# EAGLE design Yun_Shield.v1.1 (EAGLE 6.6.0)

## Sheet 1 of 4
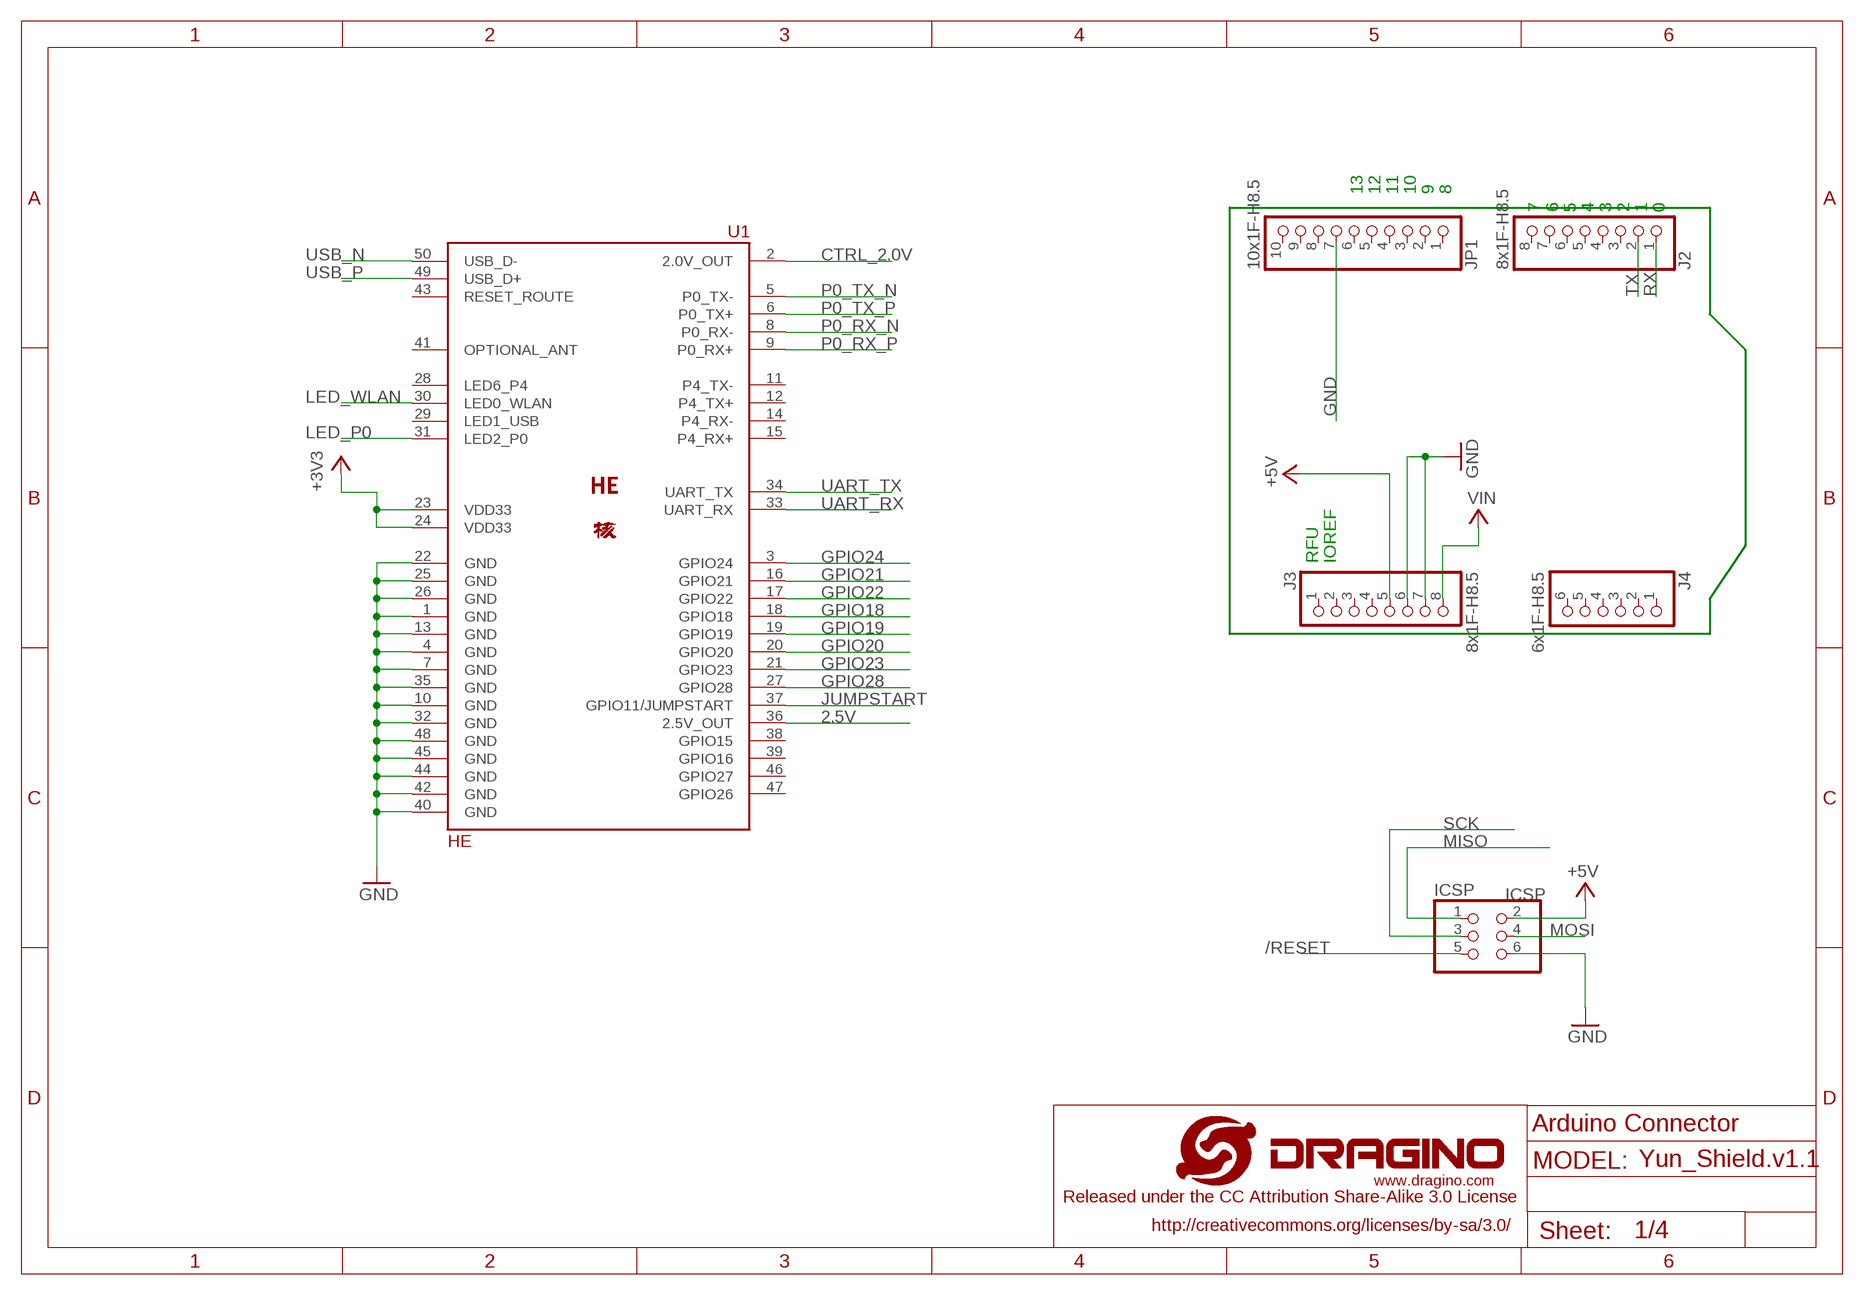
[diagram p0: schematic, sheet 1]

### Parts
ICSP  ICSP  PINHD-2X3  [2X03]
J2  8x1F-H8.5  PINHD-1X8  [1X08]
J3  8x1F-H8.5  PINHD-1X8  [1X08]
J4  6x1F-H8.5  PINHD-1X6  [1X06]
JP1  10x1F-H8.5  PINHD-1X10  [1X10]
U1  HE  [HE50]
U$1  LOGO-NEW  [LOGO-SILK-NEW]

### Nets
2.5V: U1.36(2.5V_OUT) ; also sheet 3
+3V3: U1.23(VDD33) U1.24(VDD33) ; also sheet 2,3,4
+5V [usbvcc]: ICSP.2 J3.5 ; also sheet 2,3,4
/RESET: ICSP.5 ; also sheet 3
CTRL_2.0V: U1.2(2.0V_OUT) ; also sheet 4
GND [gnd]: ICSP.6 J3.6 J3.7 JP1.7 U1.1(GND) U1.4(GND) U1.7(GND) U1.10(GND) U1.13(GND) U1.22(GND) U1.25(GND) U1.26(GND) U1.32(GND) U1.35(GND) U1.40(GND) U1.42(GND) U1.44(GND) U1.45(GND) U1.48(GND) ; also sheet 2,3,4
GPIO18: U1.18(GPIO18) ; also sheet 3
GPIO19: U1.19(GPIO19) ; also sheet 3
GPIO20: U1.20(GPIO20) ; also sheet 3
GPIO21: U1.16(GPIO21) ; also sheet 3
GPIO22: U1.17(GPIO22) ; also sheet 3
GPIO23: U1.21(GPIO23) ; also sheet 3
GPIO24: U1.3(GPIO24) ; also sheet 3
GPIO28: U1.27(GPIO28) ; also sheet 4
JUMPSTART: U1.37(GPIO11/JUMPSTART) ; also sheet 4
LED_P0: U1.31(LED2_P0) ; also sheet 4
LED_WLAN: U1.30(LED0_WLAN) ; also sheet 4
MISO: ICSP.1 ; also sheet 3
MOSI: ICSP.4 ; also sheet 3
P0_RX_N: U1.8(P0_RX-) ; also sheet 4
P0_RX_P: U1.9(P0_RX+) ; also sheet 4
P0_TX_N: U1.5(P0_TX-) ; also sheet 4
P0_TX_P: U1.6(P0_TX+) ; also sheet 4
RX: J2.1 ; also sheet 3
SCK: ICSP.3 ; also sheet 3
TX: J2.2 ; also sheet 3
UART_RX: U1.33(UART_RX) ; also sheet 3
UART_TX: U1.34(UART_TX) ; also sheet 3
USB_N [usbtrace]: U1.50(USB_D-) ; also sheet 4
USB_P [usbtrace]: U1.49(USB_D+) ; also sheet 4
VIN: J3.8 ; also sheet 2
Unconnected: J2.3 J2.4 J2.5 J2.6 J2.7 J2.8 J3.1 J3.2 J3.3 J3.4 J4.1 J4.2 J4.3 J4.4 J4.5 J4.6 JP1.1 JP1.2 JP1.3 JP1.4 JP1.5 JP1.6 JP1.8 JP1.9 JP1.10 U1.11(P4_TX-) U1.12(P4_TX+) U1.14(P4_RX-) U1.15(P4_RX+) U1.28(LED6_P4) U1.29(LED1_USB) U1.38(GPIO15) U1.39(GPIO16) U1.43(RESET_ROUTE) U1.46(GPIO27) U1.47(GPIO26)

### Notes on the sheet
- 13 | 12 | 11 | 10 | 9 | 8
- 7 | 6 | 5 | 4 | 3 | 2 | 1 | 0
- RFU | IOREF
- Arduino Connector

## Sheet 2 of 4
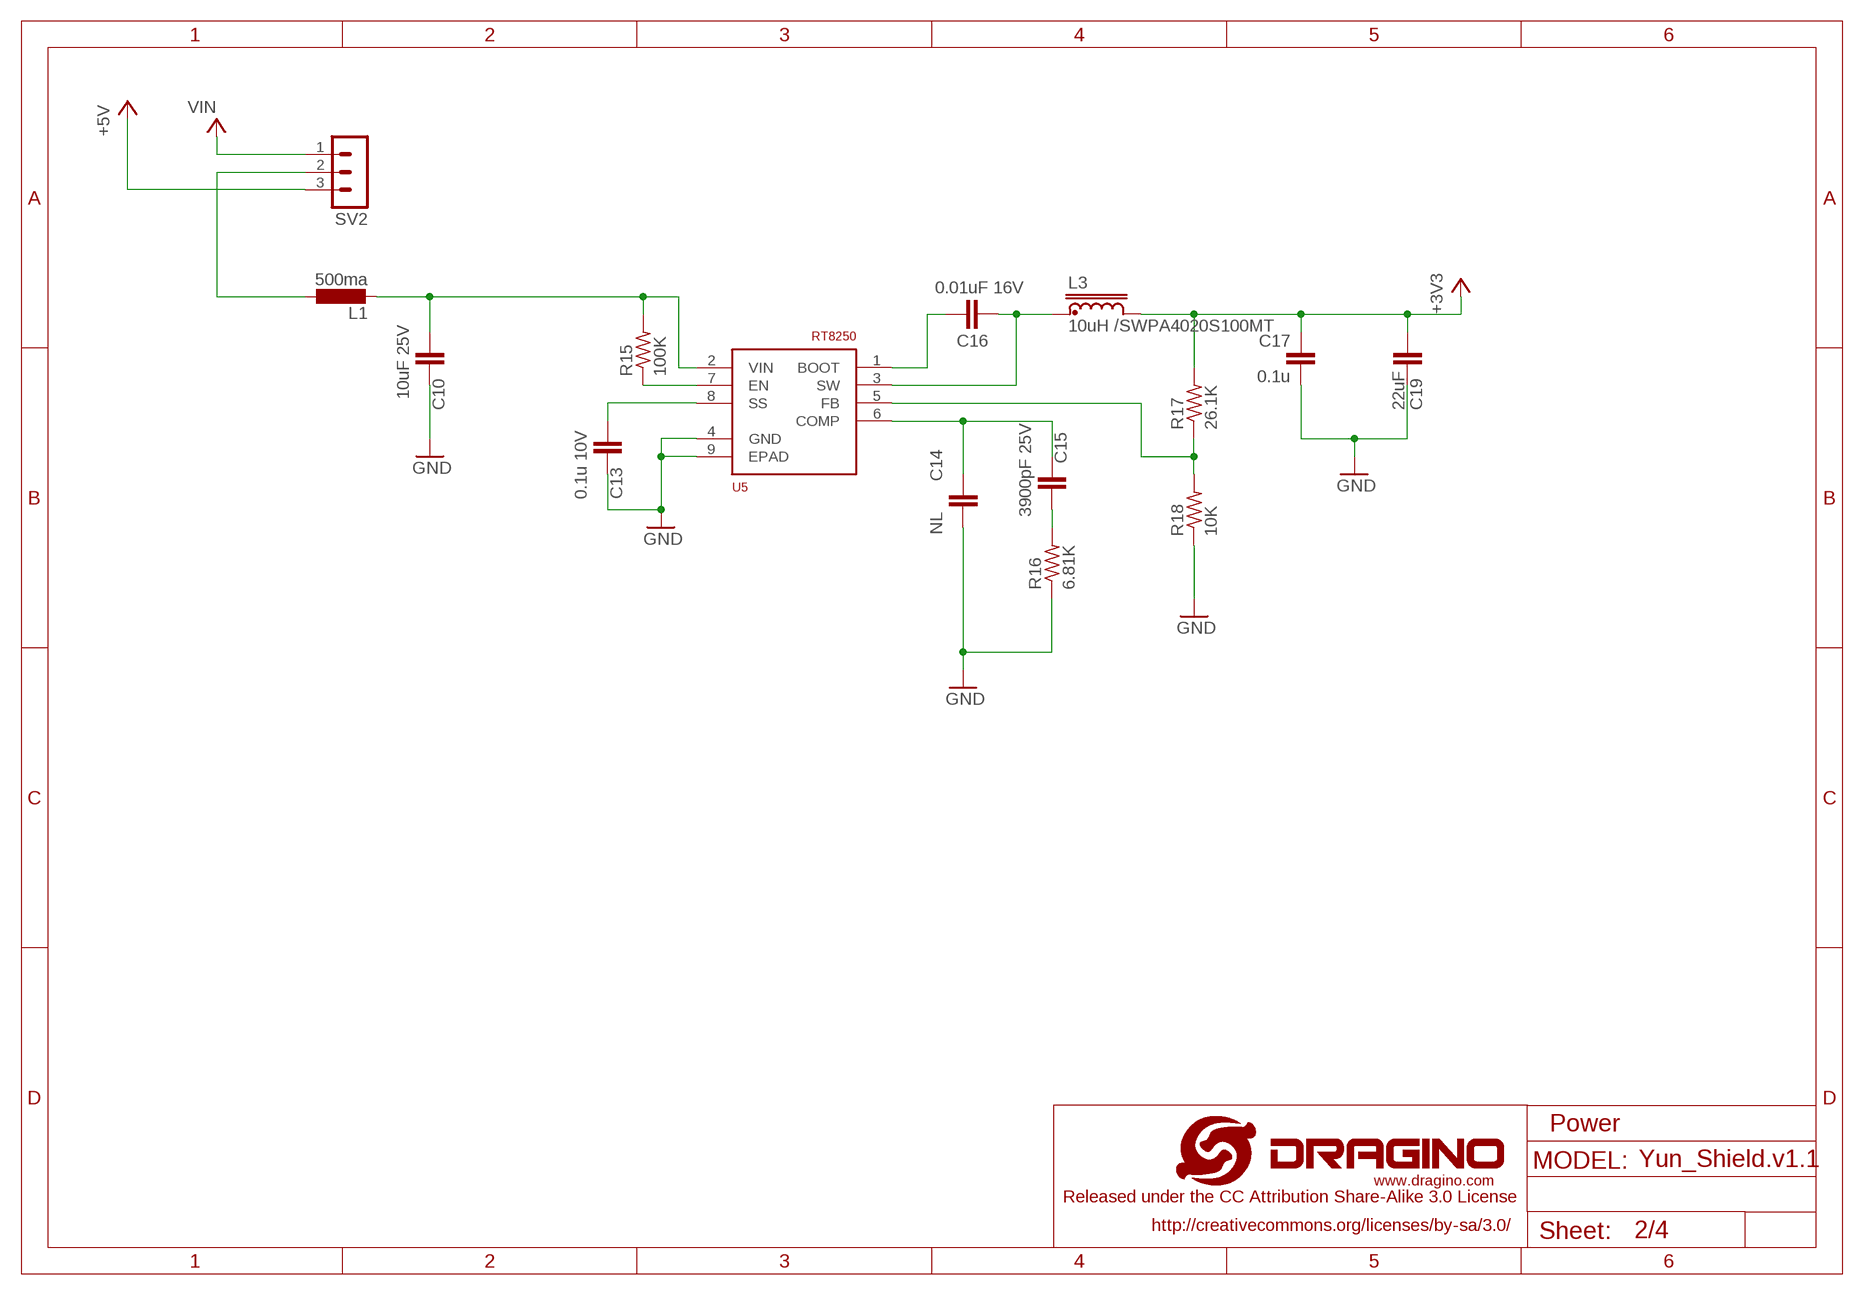
[diagram p1: schematic, sheet 2]

### Parts
C10  10uF 25V  C-EUC1206  [C1206]
C13  0.1u 10V  C-EUC0402  [C0402]
C14  NL  C-EUC0402  [C0402]
C15  3900pF 25V  C-EUC0402  [C0402]
C16  0.01uF 16V  C-EUC0402  [C0402]
C17  0.1u  C-EUC0402  [C0402]
C19  22uF  C-EUC1210  [C1210]
L1  500ma  L-EUL1812  [L1812]
L3  10uH /SWPA4020S100MT  INDUCTORSWPA4020S  [SWPA4020S]
R15  100K  R-US_R0402  [R0402]
R16  6.81K  R-US_R0402  [R0402]
R17  26.1K  R-US_R0402  [R0402]
R18  10K  R-US_R0402  [R0402]
SV2  MA03-1  [MA03-1]
U5  RT8250  [RT8250-SOP8]

### Nets
+3V3: C17.1 C19.1 L3.P$2 R17.2 ; also sheet 1,3,4
+5V [usbvcc]: SV2.3 ; also sheet 1,3,4
GND [gnd]: C10.1 C13.2 C14.2 C17.2 C19.2 R16.1 R18.1 U5.4(GND) U5.9(EPAD) ; also sheet 1,3,4
N$10: C10.2 L1.2 R15.2 U5.2(VIN)
N$13: R15.1 U5.7(EN)
N$14: R17.1 R18.2 U5.5(FB)
N$15: C13.1 U5.8(SS)
N$17: C14.1 C15.1 U5.6(COMP)
N$18: C15.2 R16.2
N$20: C16.1 U5.1(BOOT)
N$21: C16.2 L3.P$1 U5.3(SW)
VCC: L1.1 SV2.2
VIN: SV2.1 ; also sheet 1

### Notes on the sheet
- Power

## Sheet 3 of 4
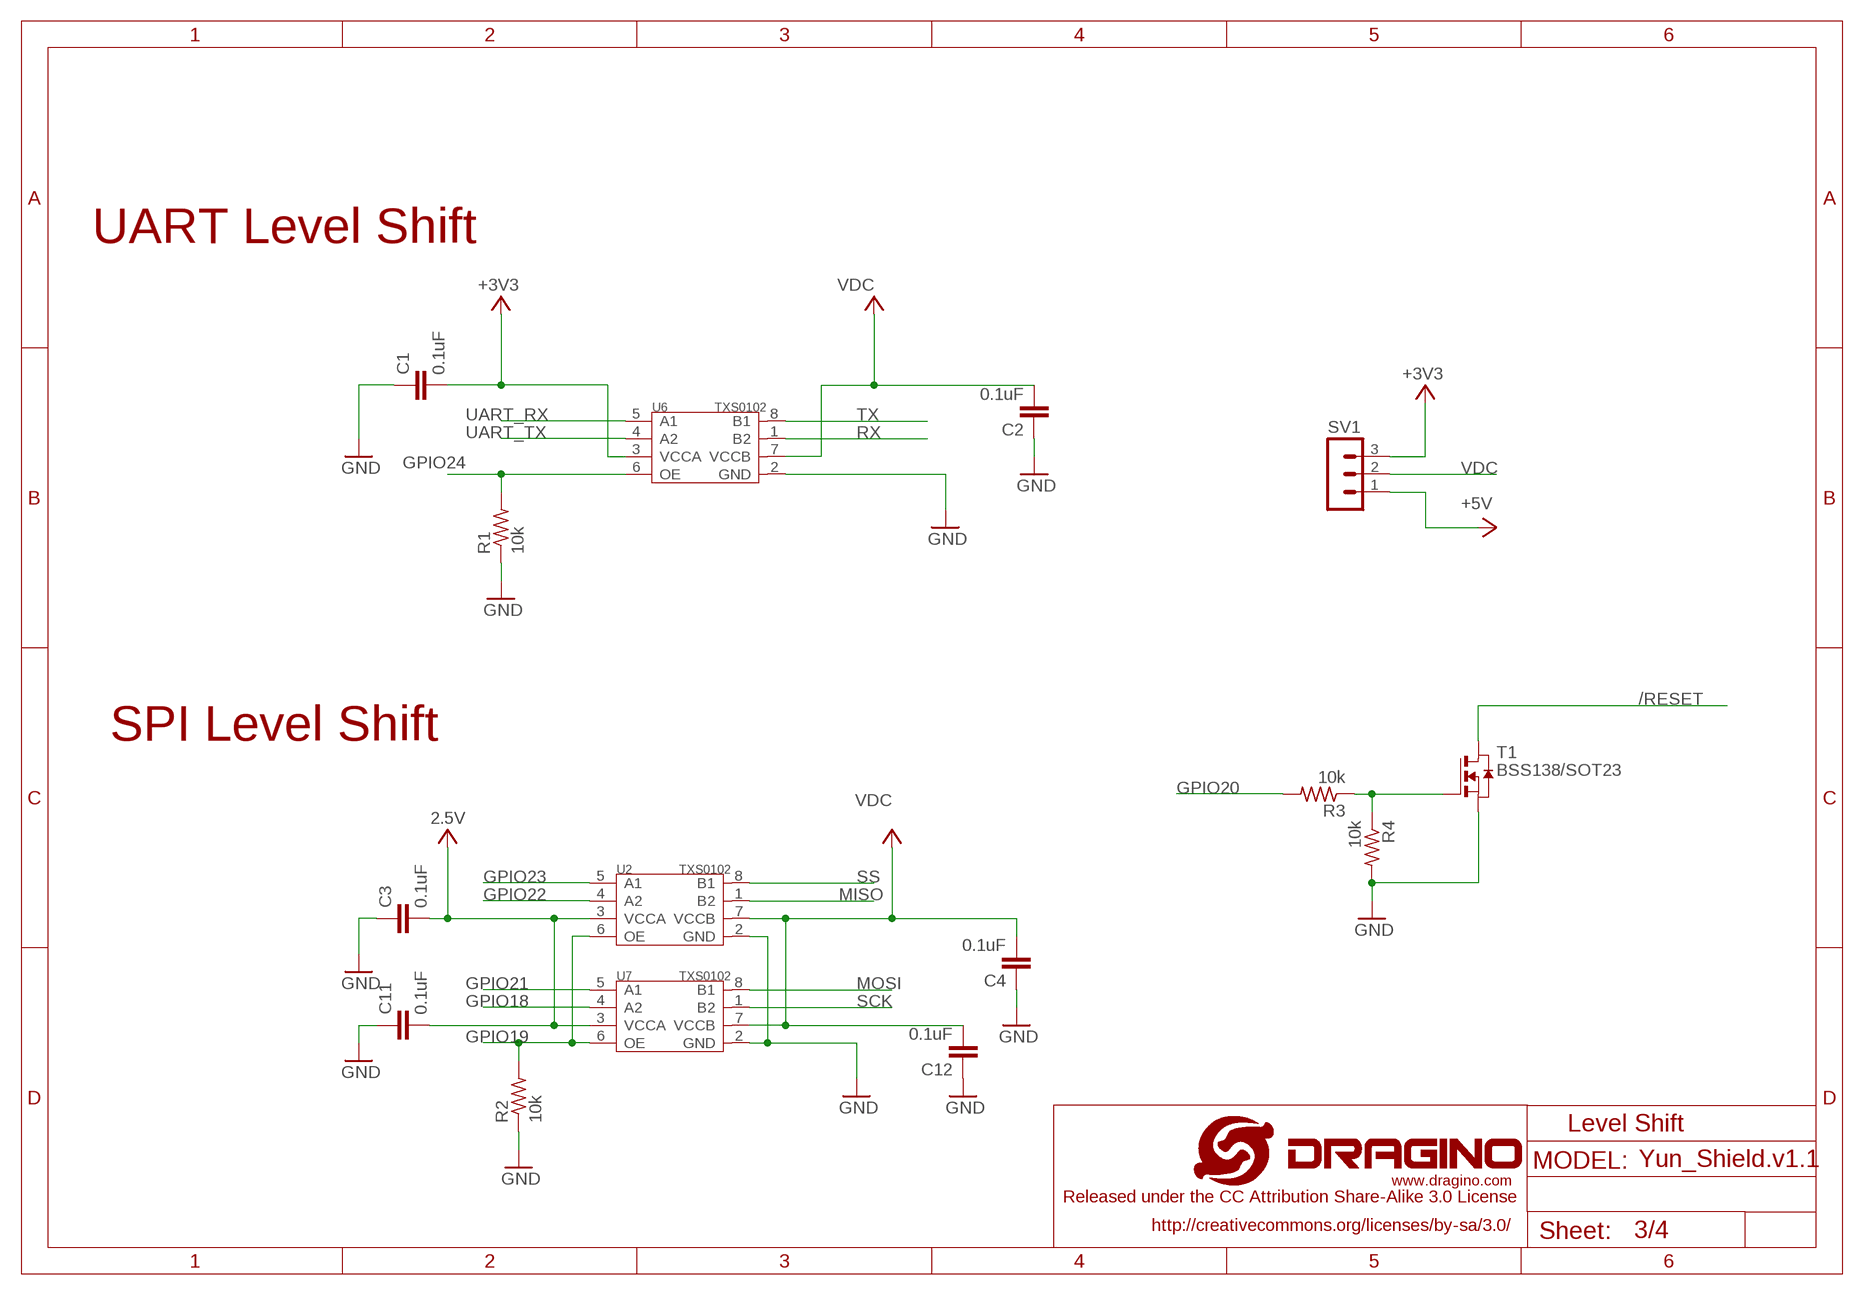
[diagram p2: schematic, sheet 3]

### Parts
C1  0.1uF  C-EUC0402  [C0402]
C2  0.1uF  C-EUC0402  [C0402]
C3  0.1uF  C-EUC0402  [C0402]
C4  0.1uF  C-EUC0402  [C0402]
C11  0.1uF  C-EUC0402  [C0402]
C12  0.1uF  C-EUC0402  [C0402]
R1  10k  R-US_R0402  [R0402]
R2  10k  R-US_R0402  [R0402]
R3  10k  R-US_R0402  [R0402]
R4  10k  R-US_R0402  [R0402]
SV1  MA03-1  [MA03-1]
T1  BSS138/SOT23  NMOSFET-SOT23  [SOT-23]
U2  TXS0102  AMLIB_NEW_TXS0102DCU  [US8]
U6  TXS0102  AMLIB_NEW_TXS0102DCU  [US8]
U7  TXS0102  AMLIB_NEW_TXS0102DCU  [US8]

### Nets
2.5V: C3.2 C11.2 U2.3(VCCA) U7.3(VCCA) ; also sheet 1
+3V3: C1.2 SV1.3 U6.3(VCCA) ; also sheet 1,2,4
+5V [usbvcc]: SV1.1 ; also sheet 1,2,4
/RESET: T1.1(D) ; also sheet 1
GND [gnd]: C1.1 C2.1 C3.1 C4.1 C11.1 C12.1 R1.1 R2.1 R4.2 T1.2(S) U2.2(GND) U6.2(GND) U7.2(GND) ; also sheet 1,2,4
GPIO18: U7.4(A2) ; also sheet 1
GPIO19: R2.2 U2.6(OE) U7.6(OE) ; also sheet 1
GPIO20: R3.2 ; also sheet 1
GPIO21: U7.5(A1) ; also sheet 1
GPIO22: U2.4(A2) ; also sheet 1
GPIO23: U2.5(A1) ; also sheet 1
GPIO24: R1.2 U6.6(OE) ; also sheet 1
MISO: U2.1(B2) ; also sheet 1
MOSI: U7.8(B1) ; also sheet 1
N$1: R3.1 R4.1 T1.3(G)
RX: U6.1(B2) ; also sheet 1
SCK: U7.1(B2) ; also sheet 1
SS: U2.8(B1)
TX: U6.8(B1) ; also sheet 1
UART_RX: U6.5(A1) ; also sheet 1
UART_TX: U6.4(A2) ; also sheet 1
VDC [usbvcc]: C2.2 C4.2 C12.2 SV1.2 U2.7(VCCB) U6.7(VCCB) U7.7(VCCB)

### Notes on the sheet
- UART Level Shift
- SPI Level Shift
- Level Shift

## Sheet 4 of 4
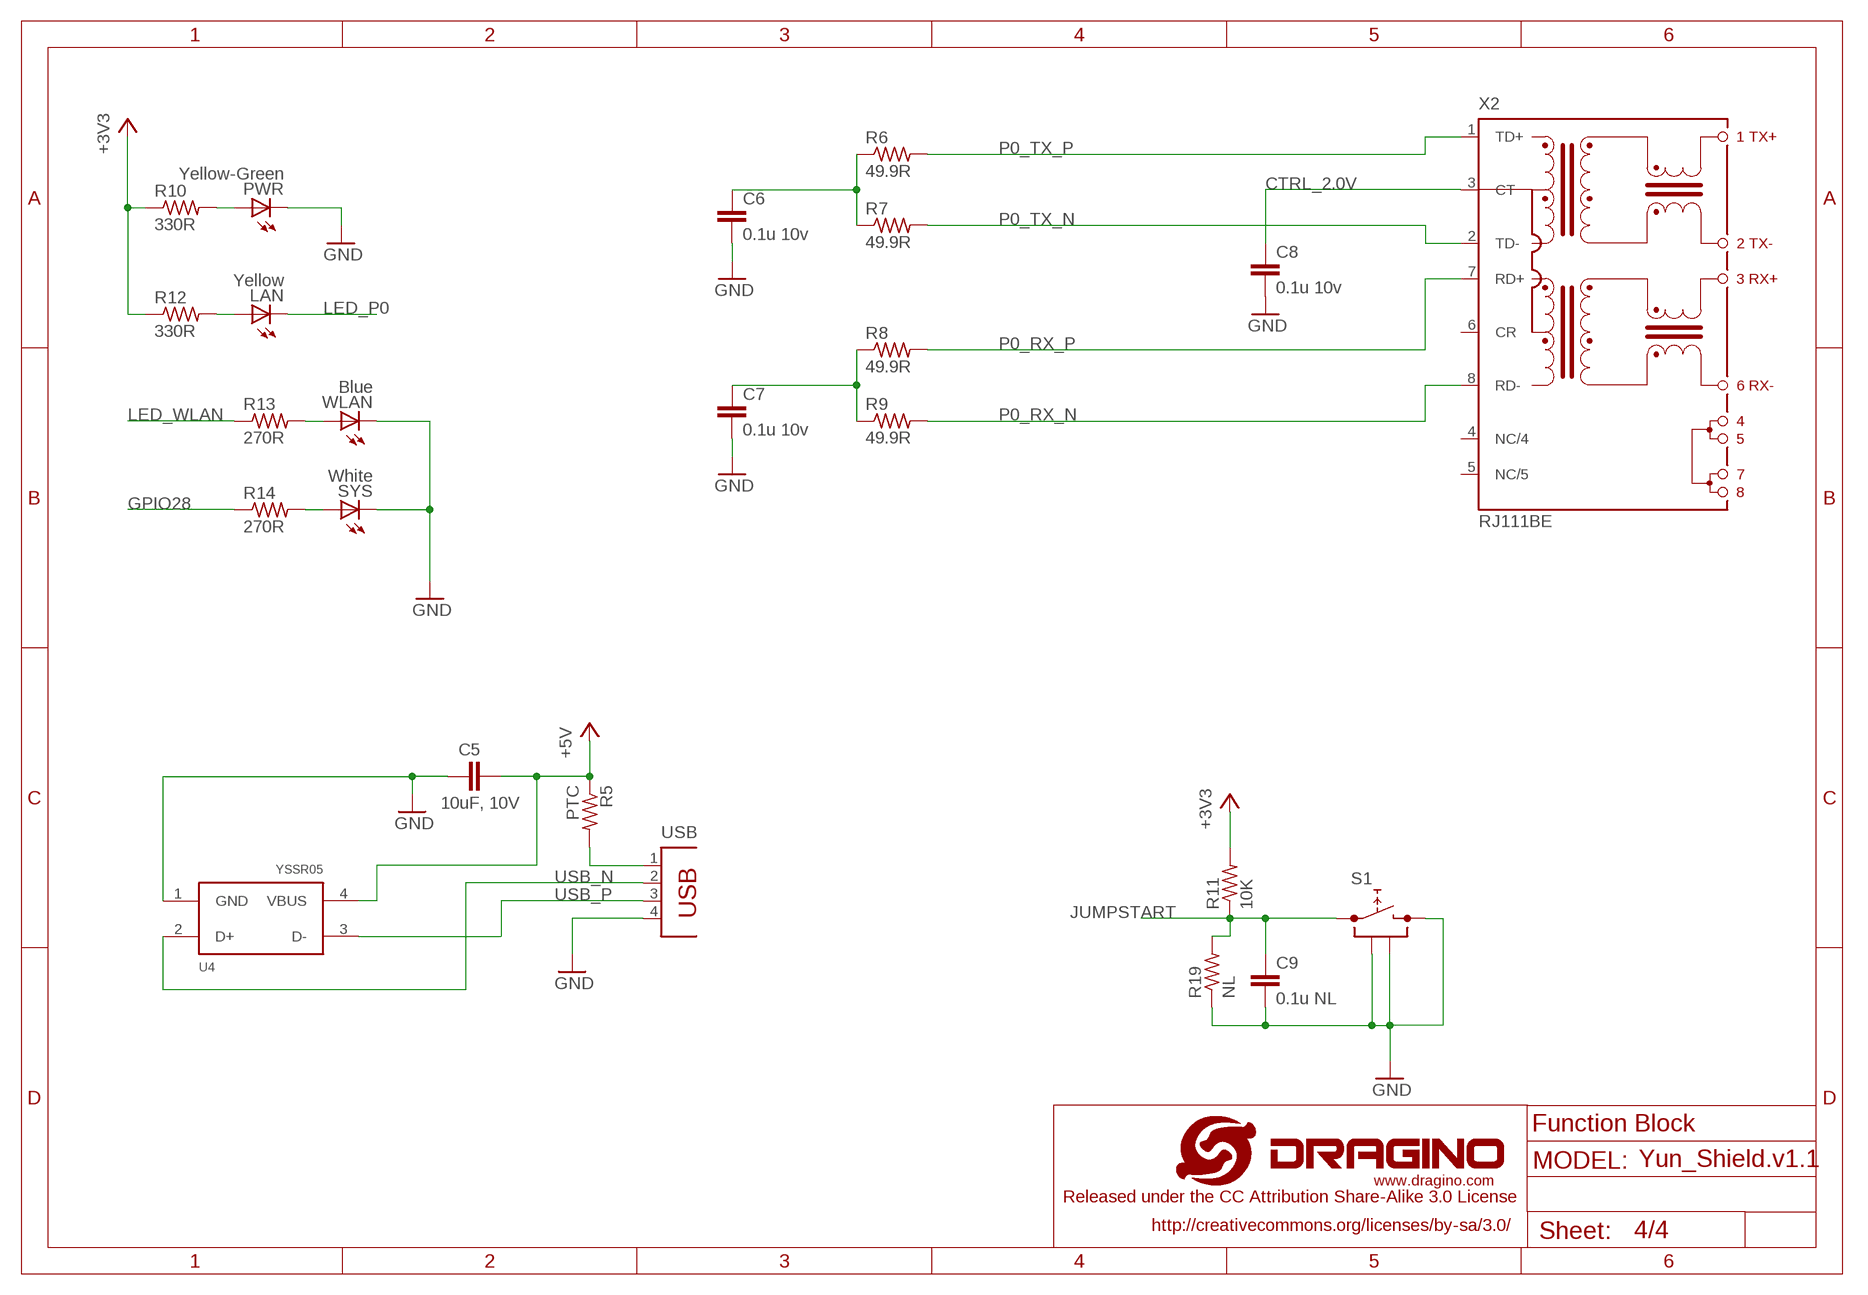
[diagram p3: schematic, sheet 4]

### Parts
C5  10uF, 10V  C-EUC0805  [C0805]
C6  0.1u 10v  C-EUC0402  [C0402]
C7  0.1u 10v  C-EUC0402  [C0402]
C8  0.1u 10v  C-EUC0402  [C0402]
C9  0.1u NL  C-EUC0402  [C0402]
LAN  Yellow  LEDCHIP-LED0603  [CHIP-LED0603]
PWR  Yellow-Green  LEDCHIP-LED0603  [CHIP-LED0603]
R5  PTC  R-US_R0805  [R0805]
R6  49.9R  R-US_R0402  [R0402]
R7  49.9R  R-US_R0402  [R0402]
R8  49.9R  R-US_R0402  [R0402]
R9  49.9R  R-US_R0402  [R0402]
R10  330R  R-US_R0402  [R0402]
R11  10K  R-US_R0402  [R0402]
R12  330R  R-US_R0402  [R0402]
R13  270R  R-US_R0402  [R0402]
R14  270R  R-US_R0402  [R0402]
R19  NL  R-US_R0402  [R0402]
S1  PUSH_SWITCH  [SWITCH_6X6X5]
SYS  White  LEDCHIP-LED0603  [CHIP-LED0603]
U4  YSSR05  [SOT143]
USB  PN87520  [PN87520]
WLAN  Blue  LEDCHIP-LED0603  [CHIP-LED0603]
X2  RJ111BE  [RJ111BE]

### Nets
+3V3: R10.1 R11.2 R12.1 ; also sheet 1,2,3
+5V [usbvcc]: C5.1 R5.1 U4.4(VBUS) ; also sheet 1,2,3
CTRL_2.0V: C8.1 X2.3(CT) ; also sheet 1
GND [gnd]: C5.2 C6.2 C7.2 C8.2 C9.2 PWR.C R19.1 S1.2 S1.3 S1.4 SYS.C U4.1(GND) USB.4 WLAN.C ; also sheet 1,2,3
GPIO28: R14.1 ; also sheet 1
JUMPSTART: C9.1 R11.1 R19.2 S1.1 ; also sheet 1
LED_P0: LAN.C ; also sheet 1
LED_WLAN: R13.1 ; also sheet 1
N$2: R5.2 USB.1
N$3: C6.1 R6.1 R7.1
N$4: PWR.A R10.2
N$5: C7.1 R8.1 R9.1
N$6: LAN.A R12.2
N$8: R13.2 WLAN.A
N$9: R14.2 SYS.A
P0_RX_N: R9.2 X2.8(RD-) ; also sheet 1
P0_RX_P: R8.2 X2.7(RD+) ; also sheet 1
P0_TX_N: R7.2 X2.2(TD-) ; also sheet 1
P0_TX_P: R6.2 X2.1(TD+) ; also sheet 1
USB_N [usbtrace]: U4.2(D+) USB.2 ; also sheet 1
USB_P [usbtrace]: U4.3(D-) USB.3 ; also sheet 1
Unconnected: X2.4(NC/4) X2.5(NC/5) X2.6(CR)

### Notes on the sheet
- Function Block

## Power pins joined to a net without a drawn wire
OPTIONAL_ANT: U1.41(OPTIONAL_ANT)

## Library data of the parts
C1-C17 C19 = dragino:C-EU: CAPACITOR, European symbol
ICSP = SmartPrj:PINHD-2X3: PIN HEADER
J2 J3 = SmartPrj:PINHD-1X8: PIN HEADER
J4 = SmartPrj:PINHD-1X6: PIN HEADER
JP1 = SmartPrj:PINHD-1X10: PIN HEADER
L1 = dragino:L-EU: INDUCTOR, European symbol
L3 = dragino:INDUCTOR: CHOKE U15
LAN PWR SYS WLAN = dragino:LED: LED OSRAM: - CHIPLED LG R971, LG N971, LY N971, LG Q971, LY Q971, LO R971, LY R971 LH N974, LH R974 LS Q976, LO Q976, LY Q976 LO Q996 - Hyper CHIPLED LW Q18S LB Q993, LB Q99A, LB R99A - SideLED LS A670, LO A670, LY A670, LG A670, LP A670 LB A673, LV A673, LT A673, LW A673 LH A674 LY A675 LS A676, LA A676, LO A676, LY A676, LW A676 LS A679, LY A679, LG A679 - Hyper Micro SIDELED® LS Y876, LA Y876, LO Y876, LY Y876 LT Y87S - SmartLED LW L88C, LW L88S LB L89C, LB L89S, LG L890 LS L89K, LO L89K, LY L89K LS L896, LA L896, LO L896, LY L896 - TOPLED LS T670, LO T670, LY T670, LG T670, LP T670 LSG T670, LSP T670, LSY T670, LOP T670, LYG T670 LG T671, LOG T671, LSG T671 LB T673, LV T673, LT T673, LW T673 LH T674 LS T676, LA T676, LO T676, LY T676, LB T676, LH T676, LSB T676, LW T676 LB T67C, LV T67C, LT T67C, LS T67K, LO T67K, LY T67K, LW E67C LS E67B, LA E67B, LO E67B, LY E67B, LB E67C, LV E67C, LT E67C LW T67C LS T679, LY T679, LG T679 LS T770, LO T770, LY T770, LG T770, LP T770 LB T773, LV T773, LT T773, LW T773 LH T774 LS E675, LA E675, LY E675, LS T675 LS T776, LA T776, LO T776, LY T776, LB T776 LHGB T686 LT T68C, LB T68C - Hyper Mini TOPLED® LB M676 - Mini TOPLED Santana® LG M470 LS M47K, LO M47K, LY M47K Source: http://www.osram.convergy.de LUXEON: - LUMILED® LXK2-PW12-R00, LXK2-PW12-S00, LXK2-PW14-U00, LXK2-PW14-V00 LXK2-PM12-R00, LXK2-PM12-S00, LXK2-PM14-U00 LXK2-PE12-Q00, LXK2-PE12-R00, LXK2-PE12-S00, LXK2-PE14-T00, LXK2-PE14-U00 LXK2-PB12-K00, LXK2-PB12-L00, LXK2-PB12-M00, LXK2-PB14-N00, LXK2-PB14-P00, LXK2-PB14-Q00 LXK2-PR12-L00, LXK2-PR12-M00, LXK2-PR14-Q00, LXK2-PR14-R00 LXK2-PD12-Q00, LXK2-PD12-R00, LXK2-PD12-S00 LXK2-PH12-R00, LXK2-PH12-S00 LXK2-PL12-P00, LXK2-PL12-Q00, LXK2-PL12-R00 Source: www.luxeon.com KINGBRIGHT: KA-3528ASYC Source: www.kingbright.com
R1-R19 = dragino:R-US_: RESISTOR, American symbol
S1 = dragino:PUSH_SWITCH: PUSH SWITCH ITT-Cannon-Cannon
SV1 SV2 = con-lstb:MA03-1: PIN HEADER; OC_FARNELL: unknown; OC_NEWARK: unknown
T1 = dragino:NMOSFET-SOT23: MOS FET; OC_FARNELL: unknown; OC_NEWARK: unknown
U1 = dragino:HE
U2 U6 U7 = dragino:AMLIB_NEW_TXS0102
U4 = dragino:YSSR05: Yeashin LOW CAPACITANCE TVS DIODE ARRAY http://www.yeashin.tw/download.php?id=4588
U5 = dragino:RT8250: DC-DC Converter. http://www.richtek.com/download.jsp?t=UyUyRmFzc2V0cyUyRnByb2R1Y3RfZmlsZSUyRlJUODI1MCUyRkRTODI1MC0wNS5wZGYlM0QlM0Ql%0AM0REUzgyNTAtMDVD
U$1 = dragino:LOGO-NEW
USB = con-berg:PN87520: BERG USB connector; OC_FARNELL: unknown; OC_NEWARK: unknown
X2 = dragino:RJ111BE: RJ45 connector with transformer; OC_FARNELL: unknown; OC_NEWARK: unknown

## Net classes
0 default: width 0.254 mm, drill 0.61 mm, clearance 0.254 mm
1 power: width 0.254 mm, drill 0.61 mm, clearance 0.254 mm
2 gnd: width 0.254 mm, drill 0.61 mm, clearance 0.254 mm
3 usbvcc: width 0.254 mm, drill 0.61 mm, clearance 0.254 mm
4 aref: width 0.254 mm, drill 0.61 mm, clearance 0.254 mm
5 usbtrace: width 0.254 mm, clearance 0.152 mm

## Board
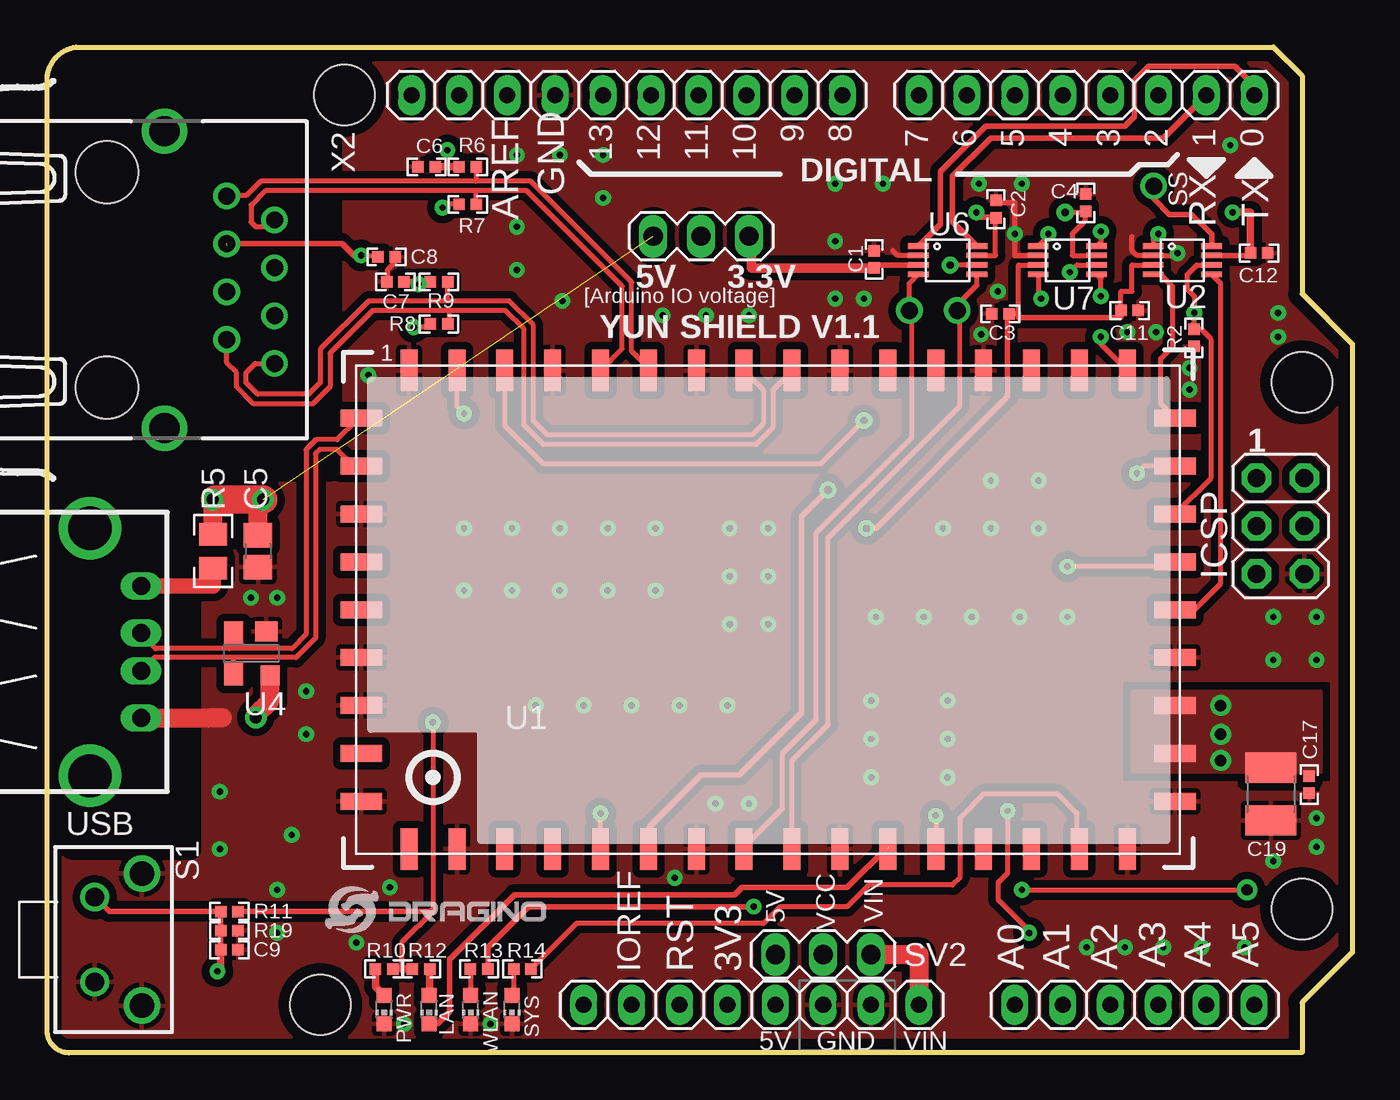
[diagram p4: board, top side]
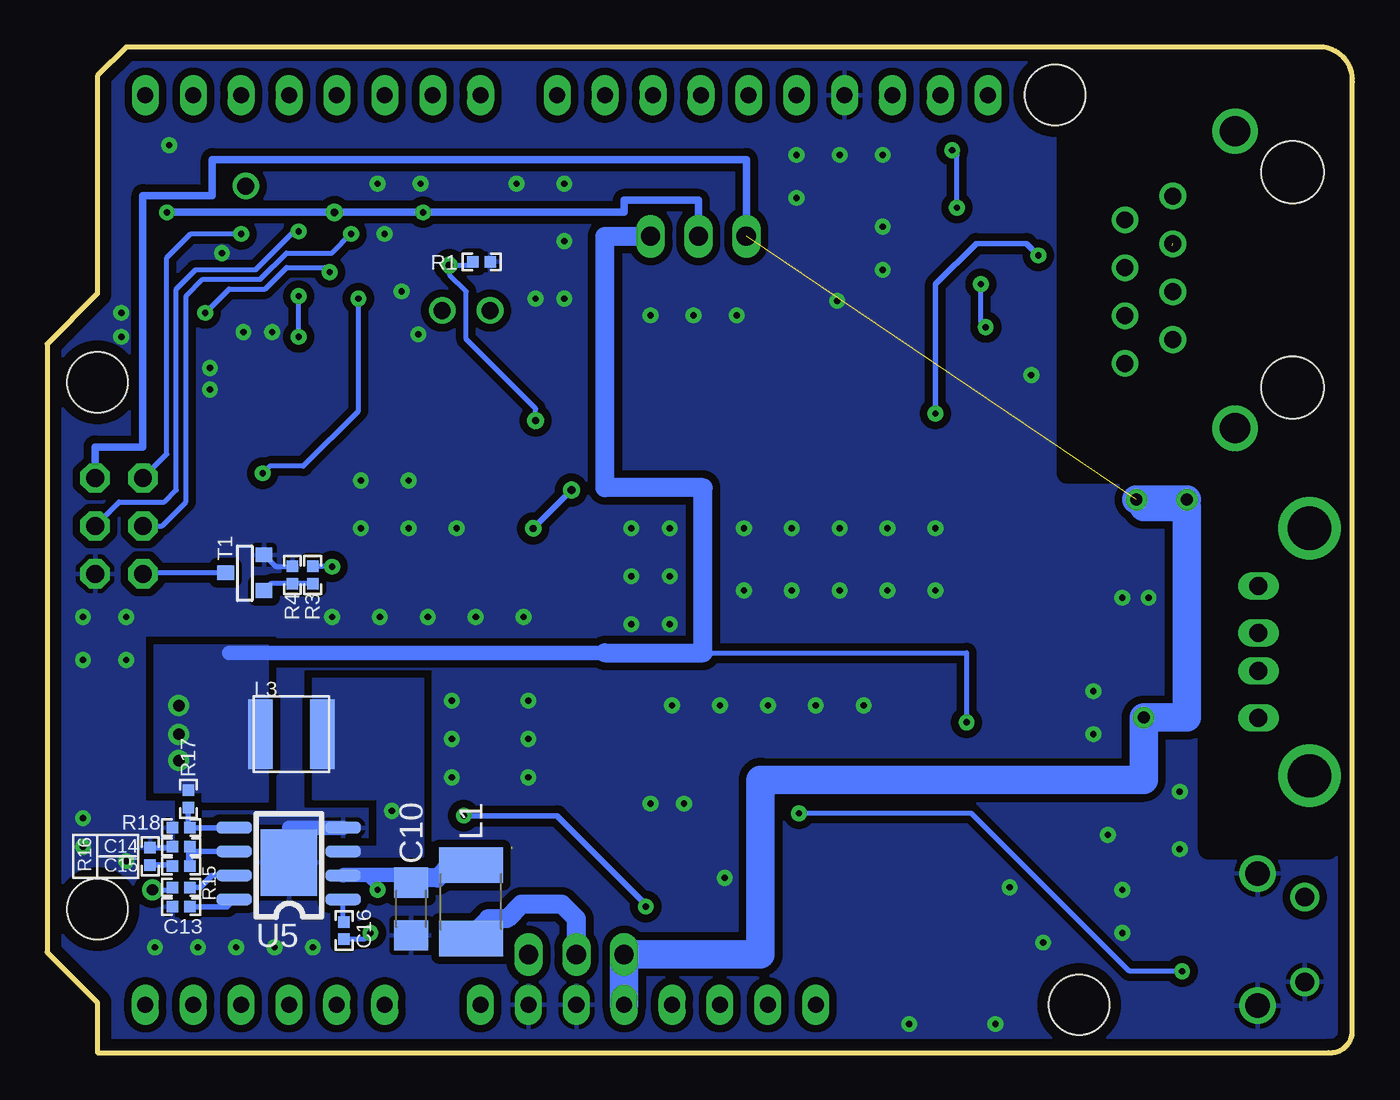
[diagram p5: board, bottom side, seen from below]

Size 69.23 x 53.35 mm. Coordinates in mm from the lower left corner, seen from the top.
Outline: 65.04,53.35 66.56,51.82 66.56,40.27 69.23,37.6 69.23,5.34 66.56,2.67 66.56,0.01 1.27,0.01 arc-90 0.02,1.02 0.02,51.35 arc-90 1.52,53.35 65.04,53.35
Copper layers (1*16): Top 0.035mm / dielectric 1.5mm / Bottom 0.035mm
Design rules "default": minimum track width 10mil, minimum drill 22mil, track to track 10mil, track to pad 10mil, pad to pad 8mil, via to via 12mil, smd to smd 8mil, copper to edge 24mil, drill to drill 12mil, minimum pad ring 10mil, minimum via ring 10mil, stop-mask expansion 2mil, vias tented up to drill 30mil, thermal gap 10mil
Holes 3.2 mm at 66.56,35.57 66.56,7.63 15.76,50.81 14.49,2.55
tRestrict: area 1.3,10.8 to 15.1,52.6
bRestrict: area 1.3,10.8 to 15.1,52.5
vRestrict: area 43.1,38.6 to 43.6,38.9; area 36.3,35.2 to 37,35.7; area 45,35.2 to 45.7,35.7; area 41.8,35.2 to 42.3,35.7; area 48.4,10.3 to 49,10.8; area 50.9,10.2 to 51.5,11.1

### Footprints (pad centres in the part's own frame; a part is rotated, then mirrored left to right if it is on the bottom)
C0402 = smd 0.61 x 0.61: 1 -0.457,0; 2 0.457,0
C0805 = smd 1.3 x 1.5: 1 -0.85,0; 2 0.85,0
C1206 = smd 1.6 x 1.8: 1 -1.4,0; 2 1.4,0
C1210 = smd 1.6 x 2.7: 1 -1.4,0; 2 1.4,0
2X03 = drill 0.95 pad 1.55 octagon: 1 -2.54,-1.27; 2 -2.54,1.27; 3 0,-1.27; 4 0,1.27; 5 2.54,-1.27; 6 2.54,1.27
1X08 = drill 0.85 pad 1.422 long: 1 -8.89,0; 2 -6.35,0; 3 -3.81,0; 4 -1.27,0; 5 1.27,0; 6 3.81,0; 7 6.35,0; 8 8.89,0
1X06 = drill 0.85 pad 1.422 long: 1 -6.35,0; 2 -3.81,0; 3 -1.27,0; 4 1.27,0; 5 3.81,0; 6 6.35,0
1X10 = drill 0.85 pad 1.422 long: 1 -11.43,0; 2 -8.89,0; 3 -6.35,0; 4 -3.81,0; 5 -1.27,0; 6 1.27,0; 7 3.81,0; 8 6.35,0; 9 8.89,0; 10 11.43,0
L1812 = smd 1.9 x 3.4: 1 -1.95,0; 2 1.95,0
SWPA4020S = smd 3.7 x 1.3: P$1 0,1.65; P$2 0,-1.65
CHIP-LED0603 = smd 0.8 x 0.8: A 0,-0.75; C 0,0.75
R0402 = smd 0.61 x 0.61: 1 -0.457,0; 2 0.457,0
R0805 = smd 1.2 x 1.5: 1 -0.9,0; 2 0.9,0
SWITCH_6X6X5 = drill 0.991 pad 1.524: 1 -2.25,0; 2 2.25,0 | drill 1.295 pad 1.905: 3 3.5,2.5; 4 -3.5,2.5
MA03-1 = drill 1.016 long: 1 -2.54,0; 2 0,0; 3 2.54,0
SOT-23 = smd 0.787 x 0.889: 1 0,-1.016; 2 -0.95,1.016; 3 0.95,1.016
HE50 = smd 0.9 x 2.198: 1 -19.05,12.69; 2 -16.51,12.69; 3 -13.97,12.69; 4 -11.43,12.69; 5 -8.89,12.69; 6 -6.35,12.69; 7 -3.81,12.69; 8 -1.27,12.69; 9 1.27,12.69; 10 3.81,12.69; 11 6.35,12.69; 12 8.89,12.69; 13 11.43,12.69; 14 13.97,12.69; 15 16.51,12.69; 16 19.05,12.69; 26 19.05,-12.69; 27 16.51,-12.69; 28 13.97,-12.69; 29 11.43,-12.69; 30 8.89,-12.69; 31 6.35,-12.69; 32 3.81,-12.69; 33 1.27,-12.69; 34 -1.27,-12.69; 35 -3.81,-12.69; 36 -6.35,-12.69; 37 -8.89,-12.69; 38 -11.43,-12.69; 39 -13.97,-12.69; 40 -16.51,-12.69; 41 -19.05,-12.69 | smd 2.198 x 0.9: 17 21.579,10.16; 18 21.579,7.62; 19 21.579,5.08; 20 21.579,2.54; 21 21.579,0; 22 21.579,-2.54; 23 21.579,-5.08; 24 21.579,-7.62; 25 21.579,-10.16; 42 -21.579,-10.16; 43 -21.579,-7.62; 44 -21.579,-5.08; 45 -21.579,-2.54; 46 -21.579,0; 47 -21.579,2.54; 48 -21.579,5.08; 49 -21.579,7.62; 50 -21.579,10.16
US8 = smd 0.3 x 1.1: 1 -0.75,-1.55; 2 -0.25,-1.55; 3 0.25,-1.55; 4 0.75,-1.55; 5 0.75,1.55; 6 0.25,1.55; 7 -0.25,1.55; 8 -0.75,1.55
SOT143 = smd 1.194 x 1.067: 1 -0.72,-1.207 | smd 0.991 x 1.194: 2 1.007,-1.143; 3 1.007,1.067 | smd 0.991 x 1.067: 4 -0.923,1.13
RT8250-SOP8 = smd 1.88 x 0.61: 1 -1.219,0; 2 -1.219,-1.27; 3 -1.219,-2.54; 4 -1.219,-3.81; 5 4.547,-3.81; 6 4.547,-2.54; 7 4.547,-1.27; 8 4.547,0 | smd 2.997 x 3.505: 9 1.651,-1.956
PN87520 = drill 0.95 long: 1 -3.5,2.71; 2 -1,2.71; 3 1,2.71; 4 3.5,2.71 | drill 2.3: P$1 -6.57,0; P$2 6.57,0
RJ111BE = drill 0.9 pad 1.3: 1 -4.445,0; 2 -3.175,2.54; 3 -1.905,0; 4 -0.635,2.54; 5 0.635,0; 6 1.905,2.54; 7 3.175,0; 8 4.445,2.54 | drill 1.6 pad 2.184: M1 -7.875,-3.3; M2 7.875,-3.3 | hole 3.3: 5.715,-6.35; -5.715,-6.35

### Placement (x,y rotation side)
C1  43.87,42.09 270 top
C2  50.33,44.75 270 top
C3  50.56,39.2 0 top
C4  55.09,45.09 270 top
C5  11.19,26.61 270 top
C6  20.13,47 180 top
C7  18.47,40.9 180 top
C8  18.01,42.22 0 top
C9  9.67,5.47 0 top
C10  49.93,7.63 90 bottom
C11  57.42,39.38 180 top
C12  64.28,42.42 180 top
C13  62.12,7.75 180 bottom
C14  62.12,10.93 180 bottom
C15  62.12,9.91 180 bottom
C16  53.48,6.48 270 bottom
C17  66.94,14.23 270 top
C19  64.91,13.72 270 top
ICSP  65.42,27.95 270 top
J2  55.13,50.81 180 top
J3  37.35,2.55 0 top
J4  57.67,2.55 0 top
JP1  30.75,50.81 180 top
L1  46.75,8.01 90 bottom
L3  56.28,16.9 270 bottom
LAN  20.26,2.29 180 top
PWR  17.87,2.29 180 top
R1  46.18,41.96 180 bottom
R2  60.83,37.92 90 top
R3  55.14,25.35 90 bottom
R4  56.22,25.35 90 bottom
R5  8.8,26.61 270 top
R6  22.31,47 0 top
R7  22.31,45.01 0 top
R8  20.78,38.66 0 top
R9  20.78,40.9 0 top
R10  17.87,4.45 180 top
R11  9.67,7.5 0 top
R12  19.84,4.45 0 top
R13  22.91,4.45 180 top
R14  25.2,4.45 180 top
R15  62.12,8.77 180 bottom
R16  63.77,10.42 270 bottom
R17  61.74,13.47 90 bottom
R18  62.12,11.94 0 bottom
R19  9.67,6.48 180 top
S1  2.52,6.01 270 top
SV1  34.69,43.31 0 top
SV2  41.16,5.21 180 top
SYS  24.65,2.29 180 top
T1  58.75,25.47 270 bottom
U1  38.24,23.5 0 top
U2  60.21,42.04 270 top
U4  10.9,21.15 180 top
U5  54.75,8.13 180 bottom
U6  47.77,42.04 270 top
U7  54.12,42.04 270 top
U$1  14.75,6.36 0 top
USB  2.27,21.26 270 top
WLAN  22.47,2.29 180 top
X2  9.52,41.01 270 top

### Tracks (layer width: path | path; a pad name or v marks a point on that pad's centre or on a via)
2.5V  (via drill 0.38, 0.41)
  Top 0.254: C11.2 56.96,40.39 57.55,40.39 57.55,41.79 U2.3 | 51.53,39 51.53,41.79 U7.3
  Top 0.305: C11.2 56.96,39 51.53,39 51.53,39.2 C3.2 50.94,39.2 50.94,34.8 43.96,27.82 v43.45,27.82 | U1.36 31.89,11.94 34.69,14.74 36.72,14.74 40.02,18.04 40.02,28.45 v41.42,29.85
  Bottom 0.305: v41.42,29.85 v43.45,27.82
+3V3  (via drill 0.33, 0.6)
  Top 0.254: 19.45,4.45 R12.1 19.32,4.45 | v20.46,17.53 20.46,7.63 20.46,7.5 18.81,5.85 18.81,4.45 R10.1
  Top 0.305: R11.2 20.34,7.5 20.46,7.63 | C1.2 43.87,41.79 U6.3
  Top 0.406: R10.1 19.32,4.45
  Top 0.508: C1.2 37.35,41.63 37.35,43.31 SV1.3
  Bottom 0.254: 39.77,21.22 39.64,21.09 39.64,21.22 | 34.43,21.22 20.46,21.22 v20.46,17.53
  Bottom 0.762: 59.58,21.22 39.77,21.22
  Bottom 1.016: 39.64,21.22 34.43,21.22 34.43,29.98 39.64,29.98 39.64,43.31 SV1.3
  other vias: 62.25,18.42 62.25,16.9 62.25,15.5
  pour Bottom (no thermals): 57.55,20.71 57.55,13.34 60.98,13.34 60.98,13.85 63.52,13.85 63.52,21.6 57.55,21.6
  pour Top (no thermals): 57.55,19.18 67.58,19.18 67.58,14.87 57.55,14.87
+5V  (via drill 0.64)  (1 unrouted)
  Top 0.254: U4.4 11.83,20.2
  Top 1.016: v11.06,17.79 11.06,17.91 11.83,18.68 U4.4 | C5.1 11.19,29.08 v11.45,29.34 | 8.91,29.34 8.78,29.22 | v8.78,29.34 8.78,27.48 R5.1
  Top 1.524: v11.45,29.34 8.91,29.34
  Bottom 0.406: ICSP.2 66.69,32.14 64.15,32.14 64.15,45.47 60.47,45.47 60.47,47.38 32.15,47.38 SV1.1
  Bottom 1.016: 11.06,28.96 v11.45,29.34
  Bottom 1.524: 11.06,28.96 8.78,28.96 8.78,17.79 v11.06,17.79 11.06,14.48 31.38,14.48 31.38,5.21 SV2.3 J3.5 | v11.45,29.34 v8.78,29.34
/RESET
  Bottom 0.254: ICSP.5 64.09,25.47 60.85,25.47 T1.1
CTRL_2.0V  (via drill 0.33)  (1 unrouted)
  Top 0.254: v16.65,42.3 17.54,42.3 C8.1 | C8.1 | C8.1 17.54,42.17 | v22.11,33.92 21.73,34.3 U1.2
  Top 0.305: v16.65,42.3 16.27,42.3 15.64,42.93 9.67,42.93 9.54,42.81
  Bottom 0.305: v22.11,33.92 22.11,40.77 19.95,42.93 17.29,42.93 v16.65,42.3
GND  (via drill 0.33)
  Top 0.254: C8.2 18.46,41.95 18.05,41.54 18.05,40.93 C7.2 | 8.65,17.79 8.52,17.79 8.5,17.76 | 57.55,43.31 57.55,42.55 57.8,42.29 U2.2 59.83,42.29 v59.96,42.42 | U6.2 45.1,42.29 44.85,42.55
  Top 0.305: U7.2 51.32,42.29 51.32,45.09 50.33,45.09 C2.1
  Top 1.016: USB.4 8.5,17.76 | 8.65,17.79 9.29,17.79
  Bottom 0.254: T1.2 57.12,25.8 R4.2
  Bottom 0.305: C14.2 62.63,10.88 R16.1
  Bottom 0.762: U5.4 56.4,11.94 U5.9
  other vias: 16.4,5.85 18.94,1.53 23.51,1.53 54.12,23.12 10.81,24.14 12.21,24.14 43.7,18.68 47.77,18.68 37.23,39.12 27.32,39.88 24.91,43.82 17.03,35.95 55.13,5.59 57.17,5.59 59.2,5.59 61.23,5.59 43.7,16.64 47.77,16.64 47.77,14.61 43.7,14.61 25.92,18.42 24.65,24.52 24.91,41.54 24.91,47.63 27.19,47.63 29.48,47.63 29.48,45.35 34.94,39.12 32.65,39.12 51.58,23.12 49.04,23.12 46.5,23.12 12.97,11.56 12.21,8.64 12.21,6.36 18.18,8.77 13.73,16.9 13.73,19.18 9.16,13.85 9.16,10.8 63.52,5.59 67.33,12.45 67.33,10.93 65.04,10.17 65.04,20.83 67.33,20.83 67.33,23.12 65.04,23.12 49.55,38.11 49.42,46.11 60.59,35.19 60.59,36.33 33.29,9.28 35.45,13.21 37.23,13.21 43.96,23.12 27.19,24.52 29.73,24.52 32.27,24.52 22.11,24.52 28.46,18.42 31,18.42 33.54,18.42 36.08,18.42 44.34,46.11 41.8,46.11 41.8,43.06 41.8,40.01 43.32,40.01 51.7,46.11 57.29,38.23 58.82,38.23 51.32,43.44 50.43,40.39 24.65,27.82 27.19,27.82 29.73,27.82 32.27,27.82 22.11,27.82 47.51,27.82 50.05,27.82 52.59,27.82 52.59,30.36 50.05,30.36 65.29,37.98 65.29,39.25 62.75,48.14 36.21,27.82 38.24,27.82 36.21,25.28 36.21,22.74 38.24,25.28 38.24,22.74
  pour Top (isolate 0.406, rank 2): 70.75,53.98 70.75,0.39 2.29,0.39 arc-90 0.52,1.64 0.52,53.98
  pour Bottom (isolate 0.406, rank 2): 70.75,53.98 70.75,0.39 2.29,0.39 arc-90 0.52,1.64 0.52,53.98
GPIO18  (via drill 0.33)
  Top 0.254: U1.18 58.18,31.12 v57.8,30.74 | U7.4 52.57,40.16 v52.72,40.01
  Bottom 0.254: v52.72,40.01 52.72,34.04 55.64,31.12 57.42,31.12 v57.8,30.74
GPIO19  (via drill 0.33)
  Top 0.254: U2.6 60.98,41.79 60.47,41.28 60.47,40.52 60.85,40.14 v60.85,39.25 60.83,39.23 R2.2 | U1.19 61.74,30.5 61.74,37.85 61.21,38.38 R2.2 | R2.2 60.83,38.76 | v54.24,41.41 54.63,41.79 U7.6
  Bottom 0.254: v60.85,39.25 59.58,40.52 57.67,40.52 56.53,41.66 54.5,41.66 v54.24,41.41
GPIO20  (via drill 0.33)
  Top 0.254: v54.12,25.79 59.55,25.79 59.8,26.04 U1.20
  Bottom 0.254: v54.12,25.79 54.13,25.8 R3.2
GPIO21  (via drill 0.33)
  Top 0.254: v55.9,37.98 55.9,37.58 55.91,37.58 U1.16 | v55.9,40.14 55.9,41.07 55.68,41.29 U7.5
  Bottom 0.254: v55.9,37.98 v55.9,40.14
GPIO22
  Top 0.254: U1.17 59.07,34.41 59.07,36.84 59.71,37.47 59.71,40.65 59.06,41.29 U2.4
GPIO23
  Top 0.254: U1.21 60.85,23.5 62.25,24.9 62.25,40.81 U2.5
GPIO24  (via drill 0.33, 0.38)
  Top 0.254: U1.3 24.27,33.28 26.3,31.25 41.04,31.25 v43.32,33.53 | U6.6 v47.9,41.79 v47.89,41.79
  Bottom 0.254: v43.32,33.53 43.32,34.17 47.01,37.85 47.01,40.39 47.9,41.29 v47.9,41.79 | v47.89,41.79 46.81,41.79 R1.2
GPIO28
  Top 0.254: R14.1 28.07,6.86 37.99,6.86 38.88,7.75 42.43,7.75 43.58,8.9 48.02,8.9 48.4,9.28 48.4,12.45 49.67,13.72 53.61,13.72 54.63,12.71 54.63,10.94 U1.27
JUMPSTART  (via drill 0.33)
  Top 0.254: U1.37 v29.35,12.71
  Top 0.305: S1.1 3.28,7.5 R11.1 R19.2 C9.1
  Top 0.406: v29.36,12.7 v29.35,12.71 | C9.1 9.21,4.5 v9.03,4.32
  Bottom 0.254: v9.03,4.32 11.83,4.32 20.21,12.71 v29.35,12.71
LED_P0  (1 unrouted)
  Top 0.305: 44.6,10.93 42.43,8.77 36.85,8.77 36.46,8.39 24.78,8.39 21.35,4.96 21.35,2.17 20.72,1.53 20.34,1.53 20.32,1.54 LAN.C
LED_WLAN  (via drill 0.33)
  Top 0.254: v47.14,12.57 U1.30
  Top 0.305: v47.14,12.57 v47.13,12.58 | v37.48,7.75 25.54,7.75 23.38,5.59 R13.1
  Bottom 0.305: v47.13,12.58 42.18,12.58 37.48,7.88 v37.48,7.75
MISO  (via drill 0.33)
  Top 0.254: v58.94,43.44 58.66,43.16 U2.1
  Bottom 0.254: ICSP.1 62.88,31.76 62.88,42.17 61.61,43.44 v58.94,43.44
MOSI  (via drill 0.33)
  Top 0.254: 55.27,42.79 U7.8 55.9,43.02 v55.9,43.57
  Bottom 0.254: ICSP.4 65.42,29.22 63.01,29.22 62.37,29.85 62.37,40.52 61.36,41.54 58.18,41.54 56.15,43.57 v55.9,43.57
N$1
  Bottom 0.254: T1.3 57.36,24.89 R4.1 R3.1
N$2
  Top 0.813: USB.1 8.8,24.76 R5.2
N$3  (via drill 0.33)
  Top 0.254: R6.1 21.22,47 v21.22,47.89 | R7.1 21.14,45.01 v20.97,44.84
  Top 0.406: C6.1 R6.1
  Bottom 0.254: v20.97,44.84 20.97,47.63 v21.22,47.89
N$4
  Top 0.406: R10.2 17.41,3.5 PWR.A
N$5  (via drill 0.33)
  Top 0.254: R8.1 20.15,38.49 v19.45,38.49 | C7.1 19.57,40.9 v19.7,40.77 20.33,40.77 R9.1
  Bottom 0.254: v19.45,38.49 19.7,38.74 v19.7,40.77
N$6
  Top 0.406: R12.2 20.29,3.08 LAN.A
N$8
  Top 0.254: R13.2 22.46,3.05
  Top 0.305: 22.46,3.05 WLAN.A
N$9
  Top 0.254: R14.2 24.74,3.13 SYS.A
N$10  (via drill 0.33, 0.6)
  Top 0.254: v51.7,8.64 v63.64,8.64
  Bottom 0.254: U5.2 52.47,9.4 v51.7,8.64 | v63.64,8.64 62.7,8.64 R15.2
  Bottom 0.305: C10.2 50.18,9.28 50.18,9.45
  Bottom 0.762: 49.8,9.45 50.18,9.45 53.49,9.45 U5.2
  Bottom 1.016: L1.2 47.85,9.96 48.53,9.28 49.68,9.28 C10.2
N$13
  Bottom 0.305: U5.7 60.47,9.4 61.1,8.77 R15.1
N$14
  Bottom 0.305: U5.5 R18.2 61.74,12.02 R17.1
N$15
  Bottom 0.305: U5.8 59.68,7.75 C13.1
N$17
  Bottom 0.305: U5.6 61.41,10.67 C14.1
  Bottom 0.406: C14.1 C15.1
N$18
  Bottom 0.305: C15.2 62.63,9.96 R16.2
N$20
  Bottom 0.254: C16.1 53.53,6.99 U5.1
N$21  (via drill 0.33)
  Top 0.254: v52.09,6.36 52.09,6.48 50.43,8.13 50.43,9.02 50.94,9.53 v50.94,12.83
  Bottom 0.254: U5.3 52.85,10.67 | v52.09,6.36 52.42,6.03 C16.2 | 50.94,12.58 v50.94,12.83
  pour Bottom (no thermals): 51.7,10.93 53.86,10.93 53.86,10.42 49.29,10.42 49.29,19.82 55.13,19.82 55.13,13.47 51.7,13.47
P0_RX_N
  Top 0.254: 21.22,39.88 24.5,39.88 25.8,38.59 25.8,33.51 26.54,32.77 37.38,32.77 37.99,33.39 37.99,35.16 36.97,36.18 U1.8 | 21.22,39.88 17.06,39.88 14.49,37.32 14.49,35.54 13.88,34.93 11.17,34.93 10.56,35.54 10.56,36.07 11.04,36.56 X2.8 | R9.2 21.22,40.88 21.22,39.88
P0_RX_P
  Top 0.254: 21.35,39.38 24.29,39.38 25.29,38.38 25.29,33.3 26.33,32.26 37.59,32.26 38.5,33.18 38.5,35.15 39.51,36.17 U1.9 | 21.35,39.38 17.27,39.38 15,37.11 15,35.33 14.09,34.42 10.96,34.42 10.05,35.33 10.05,36.07 9.52,36.6 X2.7 | R8.2 21.35,38.77 21.35,39.38
P0_TX_N
  Top 0.254: 22.75,45.73 25.44,45.73 30.5,40.67 30.5,37.34 U1.5 | 22.75,45.73 11.57,45.73 10.81,44.96 10.81,44.08 11.06,43.82 11.7,43.82 X2.2 | R7.2 22.76,45.71 22.75,45.73
P0_TX_P
  Top 0.254: 22.75,46.23 25.65,46.23 31,40.88 31,37.22 31.89,36.33 U1.6 | 22.75,46.23 11.32,46.23 10.56,45.47 9.54,45.47 X2.1 | R6.2 22.76,46.25 22.75,46.23
RX
  Top 0.305: J2.1 63.9,50.93 63.9,51.44 63.01,52.33 58.44,52.33 57.67,51.57 57.67,49.66 57.17,49.16 49.8,49.16 47.39,46.74 47.39,43.96 U6.1
SCK  (via drill 0.33)
  Top 0.254: v53.1,43.44 53.1,43.33 U7.1
  Bottom 0.254: ICSP.3 63.13,27.95 61.86,29.22 61.86,40.14 60.98,41.03 57.93,41.03 56.53,42.42 54.12,42.42 v53.1,43.44
SS  (via drill 0.9)
  Top 0.305: v58.69,45.98 58.69,45.3 59.53,44.46 60.72,44.46 61.76,43.41 U2.8
TX
  Top 0.305: J2.2 59.2,48.52 50.05,48.52 48.02,46.49 48.02,44.09 U6.8
UART_RX  (via drill 0.9)
  Top 0.254: U1.33 39.51,15.5 41.42,17.41 41.42,27.31 48.4,34.3 48.4,39.25 v48.28,39.38 48.28,39.68 49.32,40.72 U6.5
UART_TX  (via drill 0.9)
  Top 0.254: 36.97,10.67 U1.34 37,10.83 37,10.95 39,12.96 39,15.88 40.78,17.66 40.78,27.57 45.86,32.65 45.86,39.25 v45.74,39.38 45.74,40.81 U6.4
USB_N
  Top 0.254: 9.67,21.44 12.99,21.44 13.73,22.21 13.73,31.99 14.26,32.52 15.38,32.52 16.41,33.55 16.66,33.55 U1.50 | 9.67,21.44 5.76,21.44 4.97,22.23 4.98,22.24 USB.2 | U4.2 9.67,22.3 9.67,21.44
USB_P
  Top 0.254: 9.92,20.96 13.2,20.96 14.24,22 14.24,31.78 14.47,32.01 15.38,32.01 16.27,31.12 U1.49 | 9.92,20.96 5.68,20.96 USB.3 | U4.3 9.9,20.94 9.92,20.96
VCC
  Bottom 1.016: SV2.2 41.16,7.12 41.93,7.88 44.08,7.88 44.85,7.12 45.82,7.12 46.75,6.18 L1.1
VDC  (via drill 0.33, 0.41)
  Top 0.254: U6.7 50.31,42.3 50.31,44.02 50.33,44.04 C2.2 | v53.99,44.58 55.04,44.58 | 55.04,44.58 C4.2 | 55.04,44.58 55.04,44.11 54.37,43.44 54.37,42.29 U7.7
  Top 0.305: C12.2 63.69,42.29 U2.7 | 49.29,44.33 50.3,44.33 C2.2
  Top 0.406: v62.88,44.58 63.82,44.58 C12.2 | 49.29,44.33 v49.29,44.58
  Bottom 0.406: SV1.2 34.69,45.22 38.62,45.22 38.62,44.58 v49.29,44.58 v53.99,44.58 v62.88,44.58
VIN
  Top 1.016: SV2.1 46.24,5.21 J3.8

### Text on the board
tPlace: 13 | 12 | 11 | 10 | 9 | 8 | 7 | 6 | 5 | 4 | 3 | 2 | 1 | 0 | SS
tNames: DIGITAL | GND | AREF | RX | TX | 5V | 3.3V | [Arduino IO voltage] | YUN SHIELD V1.1 | 1 | VCC | 5V | VIN | A3 | A4 | A5 | IOREF | RST | 3V3 | A0 | A1 | A2 | 5V | GND | VIN